# Altium project PUA.PrjPcb (part 14 of 14)

## Sheet Private_CPU_SerDes.SchDoc
size D
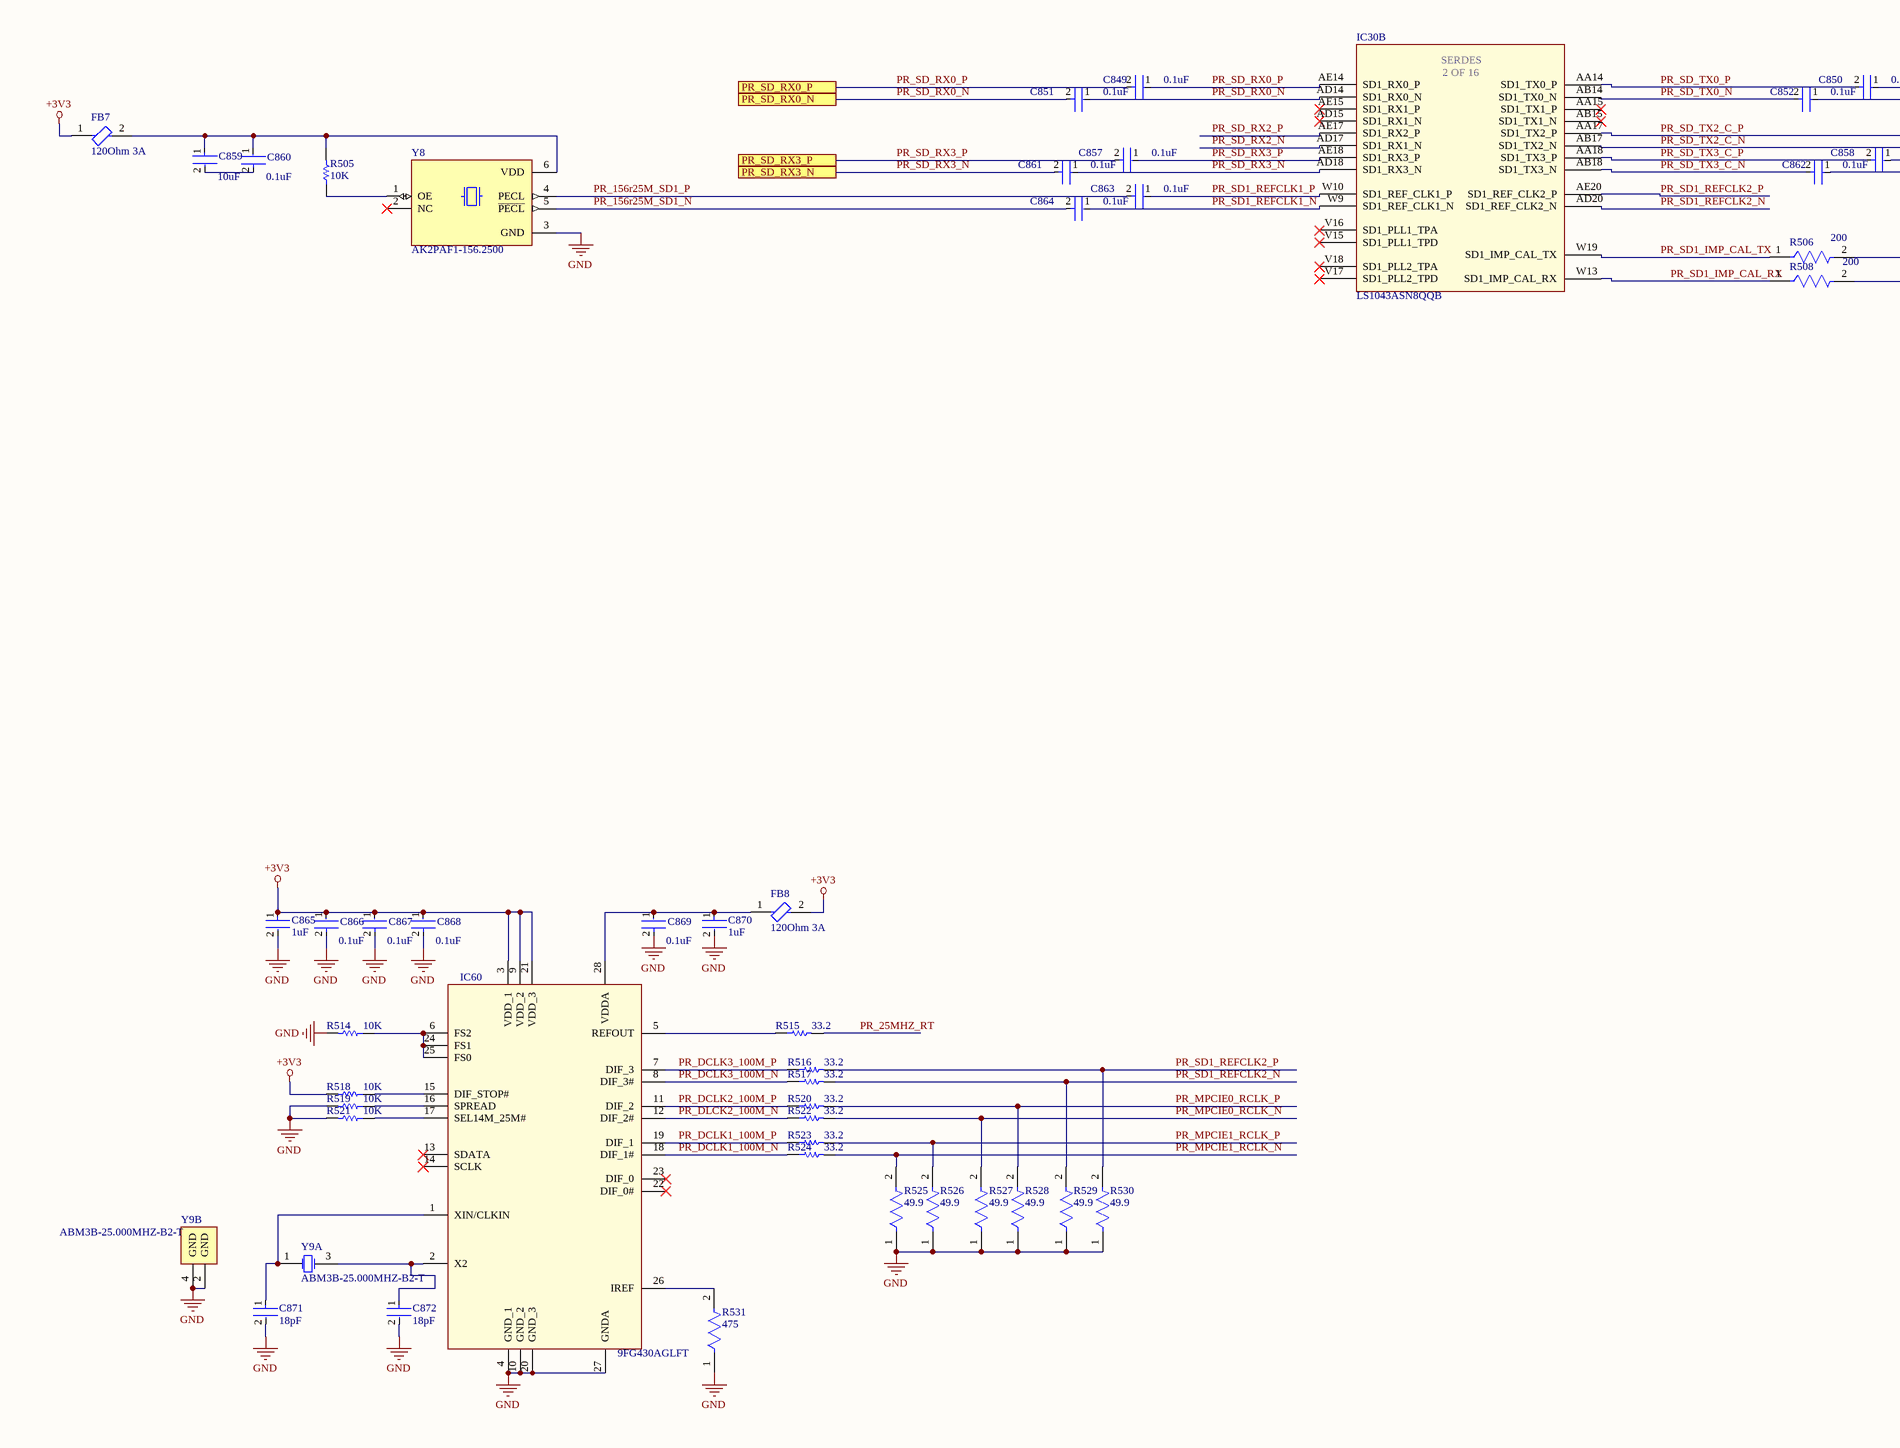
[diagram p70: Private_CPU_SerDes.SchDoc, left]
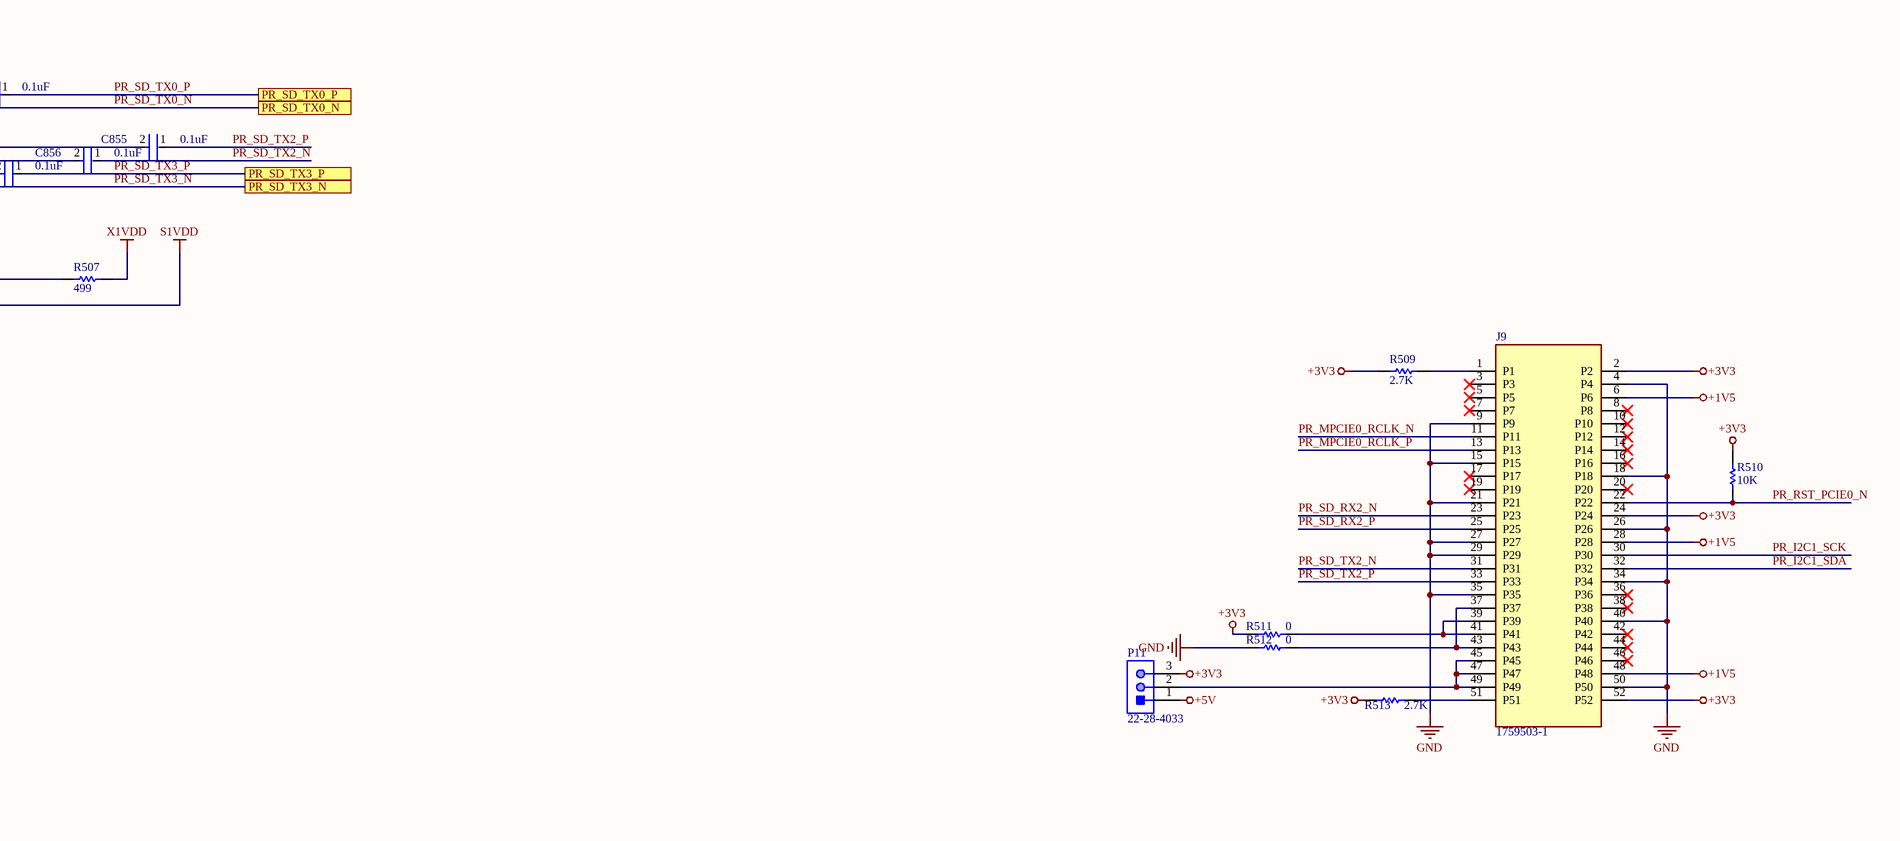
[diagram p71: Private_CPU_SerDes.SchDoc, right]

### Parts
C849  0.1uF  [FP-GRM15-MFG]
C850  0.1uF  [FP-GRM15-MFG]
C851  0.1uF  [FP-GRM15-MFG]
C852  0.1uF  [FP-GRM15-MFG]
C855  0.1uF  [FP-GRM15-MFG]
C856  0.1uF  [FP-GRM15-MFG]
C857  0.1uF  [FP-GRM15-MFG]
C858  0.1uF  [FP-GRM15-MFG]
C859  10uF  [FP-C0805C-DG-MFG]
C860  0.1uF  [FP-GRM15-MFG]
C861  0.1uF  [FP-GRM15-MFG]
C862  0.1uF  [FP-GRM15-MFG]
C863  0.1uF  [FP-GRM15-MFG]
C864  0.1uF  [FP-GRM15-MFG]
C865  1uF  [FP-GRM15-0_1-MFG]
C866  0.1uF  [FP-GRM15-MFG]
C867  0.1uF  [FP-GRM15-MFG]
C868  0.1uF  [FP-GRM15-MFG]
C869  0.1uF  [FP-GRM15-MFG]
C870  1uF  [FP-GRM15-0_1-MFG]
C871  18pF  [FP-C0402-BB-MFG]
C872  18pF  [FP-C0402-BB-MFG]
FB7  120Ohm 3A  [FP-BLM18-0_15-t0_5-d1_2-MFG]
FB8  120Ohm 3A  [FP-BLM18-0_15-t0_5-d1_2-MFG]
IC30  LS1043ASN8QQB  [BGA780C80P28X28_2300X2300X261]  (part B of 16)
IC60  9FG430AGLFT  [SOP65P640X120-28N]
J9  1759503-1  [TE_1759503-1]
P11  22-28-4033  [MOLX-22-28-4033_V]
R505  10K  [RESC1005X40X25LL05T05]
R506  200  [FP-CRCW0402-e3-IPC_C]
R507  499  [RESC1005X40X25LL05T05]
R508  200  [FP-CRCW0402-e3-IPC_C]
R509  2.7K  [RESC1005X40X25NL05T05]
R510  10K  [RESC1005X40X25LL05T05]
R511  0  [RESC2013X50X30LL20T20]
R512  0  [RESC2013X50X30LL20T20]
R513  2.7K  [RESC1005X40X25NL05T05]
R514  10K  [RESC1005X40X25LL05T05]
R515  33.2  [RESC1005X40X25LL05T05]
R516  33.2  [RESC1005X40X25LL05T05]
R517  33.2  [RESC1005X40X25LL05T05]
R518  10K  [RESC1005X40X25LL05T05]
R519  10K  [RESC1005X40X25LL05T05]
R520  33.2  [RESC1005X40X25LL05T05]
R521  10K  [RESC1005X40X25LL05T05]
R522  33.2  [RESC1005X40X25LL05T05]
R523  33.2  [RESC1005X40X25LL05T05]
R524  33.2  [RESC1005X40X25LL05T05]
R525  49.9  [FP-CRCW0402-e3-MFG]
R526  49.9  [FP-CRCW0402-e3-MFG]
R527  49.9  [FP-CRCW0402-e3-MFG]
R528  49.9  [FP-CRCW0402-e3-MFG]
R529  49.9  [FP-CRCW0402-e3-MFG]
R530  49.9  [FP-CRCW0402-e3-MFG]
R531  475  [FP-CRCW0603-e3-IPC_C]
Y8  AK2PAF1-156.2500  [XTAL_AK2PAF1-156.2500]
Y9  ABM3B-25.000MHZ-B2-T  [ABRA-ABM3B-4_V]  (parts A,B of 2)

### Ports
PR_SD_RX0_N, PR_SD_RX0_P, PR_SD_RX3_N, PR_SD_RX3_P, PR_SD_TX0_N, PR_SD_TX0_P, PR_SD_TX3_N, PR_SD_TX3_P

### Nets
+1V5: J9.6(P6) J9.28(P28) J9.48(P48)
+3V3: C865.1 C866.1 C867.1 C868.1 FB7.1 FB8.2 IC60.3(VDD_1) IC60.9(VDD_2) IC60.21(VDD_3) J9.2(P2) J9.24(P24) J9.52(P52) P11.3 R509.2 R510.2 R511.1 R513.2 R518.2
+5V: P11.1
GND: C865.2 C866.2 C867.2 C868.2 C869.2 C870.2 C871.2 C872.2 IC60.4(GND_1) IC60.10(GND_2) IC60.20(GND_3) IC60.27(GNDA) J9.4(P4) J9.9(P9) J9.15(P15) J9.18(P18) J9.21(P21) J9.26(P26) J9.27(P27) J9.29(P29) J9.34(P34) J9.35(P35) J9.40(P40) J9.50(P50) R512.1 R514.2 R519.2 R521.2 R525.1 R526.1 R527.1 R528.1 R529.1 R530.1 R531.1 Y8.3(GND) Y9.2(GND) Y9.4(GND)
S1VDD: R508.2
X1VDD: R507.2
PR_25MHZ_RT: R515.2
PR_156r25M_SD1_N: C864.2 Y8.5(~{PECL})
PR_156r25M_SD1_P: C863.2 Y8.4(PECL)
PR_DCLK1_100M_N: IC60.18(DIF_1#) R524.1
PR_DCLK1_100M_P: IC60.19(DIF_1) R523.1
PR_DCLK2_100M_P: IC60.11(DIF_2) R520.1
PR_DCLK3_100M_N: IC60.8(DIF_3#) R517.1
PR_DCLK3_100M_P: IC60.7(DIF_3) R516.1
PR_DLCK2_100M_N: IC60.12(DIF_2#) R522.1
PR_I2C1_SCK: J9.30(P30)
PR_I2C1_SDA: J9.32(P32)
PR_MPCIE0_RCLK_N: J9.11(P11) R522.2 R527.2
PR_MPCIE0_RCLK_P: J9.13(P13) R520.2 R528.2
PR_MPCIE1_RCLK_N: R524.2 R525.2
PR_MPCIE1_RCLK_P: R523.2 R526.2
PR_RST_PCIE0_N: J9.22(P22) R510.1
PR_SD1_IMP_CAL_RX: IC30.W13(SD1_IMP_CAL_RX) R508.1
PR_SD1_IMP_CAL_TX: IC30.W19(SD1_IMP_CAL_TX) R506.1
PR_SD1_REFCLK1_N: C864.1 IC30.W9(SD1_REF_CLK1_N)
PR_SD1_REFCLK1_P: C863.1 IC30.W10(SD1_REF_CLK1_P)
PR_SD1_REFCLK2_N: IC30.AD20(SD1_REF_CLK2_N) R517.2 R529.2
PR_SD1_REFCLK2_P: IC30.AE20(SD1_REF_CLK2_P) R516.2 R530.2
PR_SD_RX0_N: C851.1 C851.2 IC30.AD14(SD1_RX0_N) ; port PR_SD_RX0_N
PR_SD_RX0_P: C849.1 C849.2 IC30.AE14(SD1_RX0_P) ; port PR_SD_RX0_P
PR_SD_RX2_N: IC30.AD17(SD1_RX1_N) J9.23(P23)
PR_SD_RX2_P: IC30.AE17(SD1_RX2_P) J9.25(P25)
PR_SD_RX3_N: C861.1 C861.2 IC30.AD18(SD1_RX3_N) ; port PR_SD_RX3_N
PR_SD_RX3_P: C857.1 C857.2 IC30.AE18(SD1_RX3_P) ; port PR_SD_RX3_P
PR_SD_TX0_N: C852.1 C852.2 IC30.AB14(SD1_TX0_N) ; port PR_SD_TX0_N
PR_SD_TX0_P: C850.1 C850.2 IC30.AA14(SD1_TX0_P) ; port PR_SD_TX0_P
PR_SD_TX2_C_N: C856.2 IC30.AB17(SD1_TX2_N)
PR_SD_TX2_C_P: C855.2 IC30.AA17(SD1_TX2_P)
PR_SD_TX2_N: C856.1 J9.31(P31)
PR_SD_TX2_P: C855.1 J9.33(P33)
PR_SD_TX3_C_N: C862.2 IC30.AB18(SD1_TX3_N)
PR_SD_TX3_C_P: C858.2 IC30.AA18(SD1_TX3_P)
PR_SD_TX3_N: C862.1 ; port PR_SD_TX3_N
PR_SD_TX3_P: C858.1 ; port PR_SD_TX3_P
NetC859_1: C859.1 C860.1 FB7.2 R505.2 Y8.6(VDD)
NetC859_2: C859.2 C860.2
NetC869_1: C869.1 C870.1 FB8.1 IC60.28(VDDA)
NetC871_1: C871.1 IC60.1(XIN/CLKIN) Y9.1(X1)
NetC872_1: C872.1 IC60.2(X2) Y9.3(X2)
NetIC60_5: IC60.5(REFOUT) R515.1
NetIC60_6: IC60.6(FS2) IC60.24(FS1) IC60.25(FS0) R514.1
NetIC60_15: IC60.15(DIF_STOP#) R518.1
NetIC60_16: IC60.16(SPREAD) R519.1
NetIC60_17: IC60.17(SEL14M_25M#) R521.1
NetIC60_26: IC60.26(IREF) R531.2
NetJ9_1: J9.1(P1) R509.1
NetJ9_37: J9.37(P37) J9.43(P43) R512.2
NetJ9_39: J9.39(P39) J9.41(P41) R511.2
NetJ9_45: J9.45(P45) J9.47(P47) J9.49(P49) P11.2
NetJ9_51: J9.51(P51) R513.1
NetR505_1: R505.1 Y8.1(OE)
NetR506_2: R506.2 R507.1

Not connected (* = marked no-connect by the designer): IC30 AA15(SD1_TX1_P)* AB15(SD1_TX1_N)* AD15(SD1_RX1_N)* AE15(SD1_RX1_P)* V15(SD1_PLL1_TPD)* V16(SD1_PLL1_TPA)* V17(SD1_PLL2_TPD)* V18(SD1_PLL2_TPA)*; IC60 13(SDATA)* 14(SCLK)* 22(DIF_0#)* 23(DIF_0)*; J9 3(P3)* 5(P5)* 7(P7)* 8(P8)* 10(P10)* 12(P12)* 14(P14)* 16(P16)* 17(P17)* 19(P19)* 20(P20)* 36(P36)* 38(P38)* 42(P42)* 44(P44)* 46(P46)*; Y8 2(NC)*

### Notes on the sheet
- Title
- Size:
- Date:
- File:
- D
- Number:
- Time:
- Revision:
- Sheet
- of
- (in symbol LS1043ASN8QQB, part B) SERDES; 2 OF 16

### Library data of the parts
C849-C852 C855-C858 C860-C864 C866-C869 = CMP-2100-03641-2: as C1274 on sheet Server_CPU_Sub_Power_Supplies; RoHS: TRUE; Temperature Characteristic: X7R; Octopart: https://octopart.com/grm155r71c104ka88d-murata-196880; Digikey Description: CAP CER 0.1UF 16V X7R 0402; Device Class L3: Ceramic Capacitors; Height: 0.55mm; ComponentLink2Description: Datasheet; Temperature Range Low: -55°C; Ipc Land Pattern Name: CAPC10050X219; ComponentLink2URL: https://search.murata.co.jp/Ceramy/image/img/A01X/G101/ENG/GRM155R71H471KA01-01A.pdf; Device Class L1: Passive Components; Lead Free: yes; Category: Cap; Package: GRM15; Temperature: -55°C to +125°C; Device Class L2: Capacitors; Temperature Range High: +125°C; Mouser Description: 0402 0.1 uF 16V ±10 % Tolerance X7R SMT Multilayer Ceramic Capacitor
C859 = CMP-2007-03243-2: as C334 on sheet Public_CPU_SerDes; Device Class L2: Capacitors; Device Class L1: Passive Components; ComponentLink2URL: https://content.kemet.com/datasheets/KEM_C1006_X5R_SMD.pdf; Height: 1.4mm; Lead Free: Yes; Digikey Description: CAP CER 10UF 10V X5R 0805; Octopart: https://octopart.com/c0805c106k8pactu-kemet-98697; Capacitance: 10uF; Value: 10uF; Temperature Range Low: -55°C; Temperature: -55°C to +85°C; Automotive: No; Mouser Description: CAP CER 10UF 10V X5R 0805; Ipc Land Pattern Name: CAPC200125X125; Temperature Range High: +85°C; Voltage: 10V; RoHS: TRUE; Device Class L3: Ceramic Capacitors; ComponentLink2Description: Datasheet; Voltage Rating: 10V; Package: C0805C-DG; Temperature Characteristic: X5R; Category: Cap
C865 C870 = CMP-2008-04556-2: as C1271 on sheet Server_CPU_Sub_Power_Supplies; Octopart: https://octopart.com/grm155r61a105ke15d-murata-197442; Lead Free: Yes; ComponentLink2Description: Datasheet; Temperature: -55°C to +85°C; Temperature Range High: +85°C; Height: 0.55mm; Capacitance: 1uF; Ipc Land Pattern Name: CAPC10050X50; ComponentLink2URL: https://search.murata.co.jp/Ceramy/image/img/A01X/G101/ENG/GRM155R61A105KE15-01A.pdf; Temperature Range Low: -55°C; Device Class L2: Capacitors; Voltage Rating: 10V; RoHS: TRUE; Device Class L1: Passive Components; Device Class L3: Ceramic Capacitors; Temperature Characteristic: X5R; Mouser Description: 0402 1 uF 10 V ±10% Tolerance X5R Surface Mount Multilayer Ceramic Capacitor; Automotive: No; Package: GRM15-0.1; Digikey Description: CAP CER 1UF 10V X5R 0402; Value: 1uF; Category: Cap
C871 C872 = CMP-2008-03288-2: as C370 on sheet Public_CPU_SerDes; Ipc Land Pattern Name: CAPC10050X50; Capacitance: 18 pF; Category: Cap; RoHS: TRUE; Automotive: No; Temperature Range High: +125°C; Height: 0.55mm; ComponentLink2Description: Datasheet; Lead Free: Yes; Value: 18 pF; Device Class L3: Ceramic Capacitors; Device Class L1: Passive Components; Digikey Description: CAP CER 18PF 50V 5% NP0 0402; Device Class L2: Capacitors; Voltage Rating: 50 V; ComponentLink2URL: https://content.kemet.com/datasheets/KEM_C1002_X7R_SMD.pdf; Octopart: https://octopart.com/c0402c180j5gactu-kemet-9138803; Mouser Description: Multilayer Ceramic Capacitors MLCC - SMD/SMT 50volts 18pF C0G 5%; Temperature: -55°C to +125°C; Temperature Range Low: -55°C; Package: C0402-BB
FB7 FB8 = CMP-0686-00602-4: as FB1 on sheet Public_CPU_SerDes; Tolerance: 25%; REACH SVHC: No SVHC; Case/Package: 0603; Max DC Current: 3A; Core Material: Ferrite; Case Code (Metric): 1608; Frequency: 100MHz; Package Quantity: 1; Height: 0.8mm; Lead Free: Lead Free; Test Frequency: 100MHz; RoHS Compliant: Yes; DC Resistance-Max: 25mR; Min Operating Temperature: -55°C; Width: 0.8mm; Termination: SMD/SMT; Length: 1.6mm; Max Current Rating: 3A; Number of Lines: 1; Series: BLM18S; Number of Pins: 2; Packaging: Tape and Reel; Current Rating: 3A; Depth: 0.8mm; Case Code (Imperial): 0603; Max Operating Temperature: 125°C
IC30 = LS1043ASN8QQB: as IC1 on sheet Public_CPU_SerDes; Datasheet Link: http://www.nxp.com/secured/assets/documents/en/data-sheet/LS1088A.pdf; Height: 2.61mm; Manufacturer_Part_Number: LS1043ASN8QQB; Mouser Part Number: 771-LS1043ASN8QQB; Mouser Price/Stock: https://www.mouser.co.uk/ProductDetail/NXP-Semiconductors/LS1043ASN8QQB/?qs=AQlKX63v8RsTATOTx7X0Jg%3D%3D
IC60 = 9FG430AGLFT: as IC29 on sheet Public_CPU_SerDes; Datasheet Link: https://www.idt.com/document/dst/9fg430-datasheet; Height: 1.2mm; Manufacturer_Part_Number: 9FG430AGLFT
J9 = 1759503-1: as J5 on sheet Public_CPU_SerDes; MP: 1759503-1; Value: *; Price: None; Availability: Unavailable; Package: None
P11 = CMP-1676-00001-5: as P5 on sheet Public_CPU_SerDes; Min Operating Temperature: 0 degC; Lead Pitch: 0.1 inch; Packaging: Bulk; Contact Finish: Gold; RoHSCompliant: true; Contact Material: Brass; PackageReference: 22-28-4033; REACH SVHC: Unknown; PackageDescription: Male Header, Pitch 2.54 mm, 1 x 3 Position, Height 8.38 mm, Tail Length 3.18 mm; ComponentLink2URL: http://www.molex.com/pdm_docs/sd/022284033_sd.pdf; Height: 8.38 mm; Mounting Technology: Through Hole; ComponentLink1Description: Manufacturer URL; Length: 7.62 mm; Mount: Through Hole; DatasheetVersion: Rev. G, 01/2012; Max Operating Temperature: 75 degC; ComponentLink2Description: Datasheet; Colour: Black; Pins: 3; Contact Plating: Gold; Package Quantity: 1; ComponentLink1URL: http://www.molex.com/
R505 R510 R514 R518 R519 R521 = CMP-2000-07588-1: as R748-R751 on sheet Server_CPU_Sub_Power_Supplies; RoHSCompliant: True; Lead Free: LeadFree; Package Quantity: 1; Contact Plating: Tin; Length: 1mm; Radiation Hardening: No; REACH SVHC: NoSVHC; Max Operating Temperature: 155degC; Depth: 0.5mm; Case Code (Imperial): 0402; Military Standard: Not; Package Description: 2-Pin Surface Mount Device, Body 1 x 0.5 mm; Termination: SMD/SMT; Case Code (Metric): 1005; Height: 0.35mm; Packaging: TapeandReel; Voltage Rating (DC): 50V; Package Reference: 402; Number of Pins: 2; Tolerance: 1%; Mounting Technology: SurfaceMount; Width: 0.02inch; Mount: SurfaceMount; Datasheet URL: https://industrial.panasonic.com/cdbs/www-data/pdf/RDA0000/AOA0000C304.pdf; Composition: ThickFilm; Datasheet Version: 02/2017; Manufacturer URL: http://www.panasonic.com/; Max Power Dissipation: 100mW; Number of Terminations: 2; Min Operating Temperature: -55degC
R506 R508 = CMP-1011-00429-3: as R228 on sheet Public_CPU_SerDes; Termination: SMD/SMT; Weight: 2.3E-05oz; Case/Package: 0402; Contact Plating: Tin; Number of Pins: 2; Width: 0.5mm; Height: 0.35mm; Case Code (Metric): 1005; Military Standard: Not; Features: Automotive AEC-Q200; Power Rating: 63mW; Temperature Coefficient: 100ppm/°C; Tolerance: 1%; Lead Free: Lead Free; Depth: 0.5mm; Max Operating Temperature: 155°C; Min Operating Temperature: -55°C; Package Quantity: 10; Voltage Rating (DC): 50V; Composition: Thick Film; Mount: Surface Mount; Radiation Hardening: No; Length: 1mm; Packaging: Tape and Reel; Number of Terminations: 2; Case Code (Imperial): 0402
R507 = CMP-2002-00965-1: as R229 on sheet Public_CPU_SerDes
R509 R513 = CMP-1011-00557-2: as R196 on sheet Public_CPU_SerDes
R511 R512 = CMP-2001-04896-1: as R224 on sheet Public_CPU_SerDes
R515-R517 R520 R522-R524 = CMP-2002-08532-1: as R232-R234 on sheet Public_CPU_SerDes
R525-R530 = CMP-1011-00363-3: as R242-R247 on sheet Public_CPU_SerDes; Temperature Coefficient: 100ppm/°C; Packaging: Tape and Reel; Height: 0.35mm; Length: 1mm; Case Code (Metric): 1005; Weight: 2.3E-05oz; Case Code (Imperial): 0402; Voltage Rating (DC): 50V; Composition: Thick Film; Lead Free: Lead Free; Package Quantity: 10; Number of Terminations: 2; Width: 0.5mm; Max Operating Temperature: 155°C; Depth: 0.5mm; Max Power Dissipation: 63mW; Tolerance: 1%; Radiation Hardening: No; Features: Automotive AEC-Q200; Min Operating Temperature: -55°C; Contact Plating: Tin; Mount: Surface Mount; Military Standard: Not; Termination: SMD/SMT; Case/Package: 0402
R531 = CMP-2000-03377-2: as R248 on sheet Public_CPU_SerDes; Termination: SMD/SMT; Weight: 7.1E-05oz; Case Code (Imperial): 0603; Tolerance: 1%; Case/Package: 0603; Length: 1.55mm; Case Code (Metric): 1608; Packaging: Tape and Reel; Max Operating Temperature: 155°C; Width: 0.033inch; Temperature Coefficient: 100ppm/°C; Contact Plating: Tin; Composition: Thick Film; Voltage Rating: 75V; Number of Terminations: 2; Depth: 0.85mm; Lead Free: Lead Free; Height: 0.45mm; Features: Automotive AEC-Q200; Package Quantity: 10; Military Standard: Not; Max Power Dissipation: 100mW; Radiation Hardening: No; Min Operating Temperature: -55°C; Mount: Surface Mount
Y8 = AK2PAF1-156.2500: as Y3 on sheet Public_CPU_SerDes; Package: None; MP: AK2PAF1-156.2500; Availability: Unavailable; Price: None; Value: *
Y9 = CMP-0277-00001-1: as Y4 on sheet Public_CPU_SerDes; Case Size: 5.0 x 3.2 mm; PackageDescription: 4-Pin SMT Crystal, 5.2 x 3.4 mm Body; ComponentLink2Description: Datasheet; Mounting Technology: Surface Mount; ComponentLink1URL: http://www.abracon.com/; PackageReference: ABM3B; DatasheetVersion: Apr-13; PartNumber: ABM3B-25.000MHZ-B2-T; ComponentLink2URL: http://www.abracon.com/Resonators/abm3b.pdf; ComponentLink1Description: Manufacturer URL; Storage Temperature: -40 to 80 degC

## Sheet Server_CPU_SerDes.SchDoc
size D
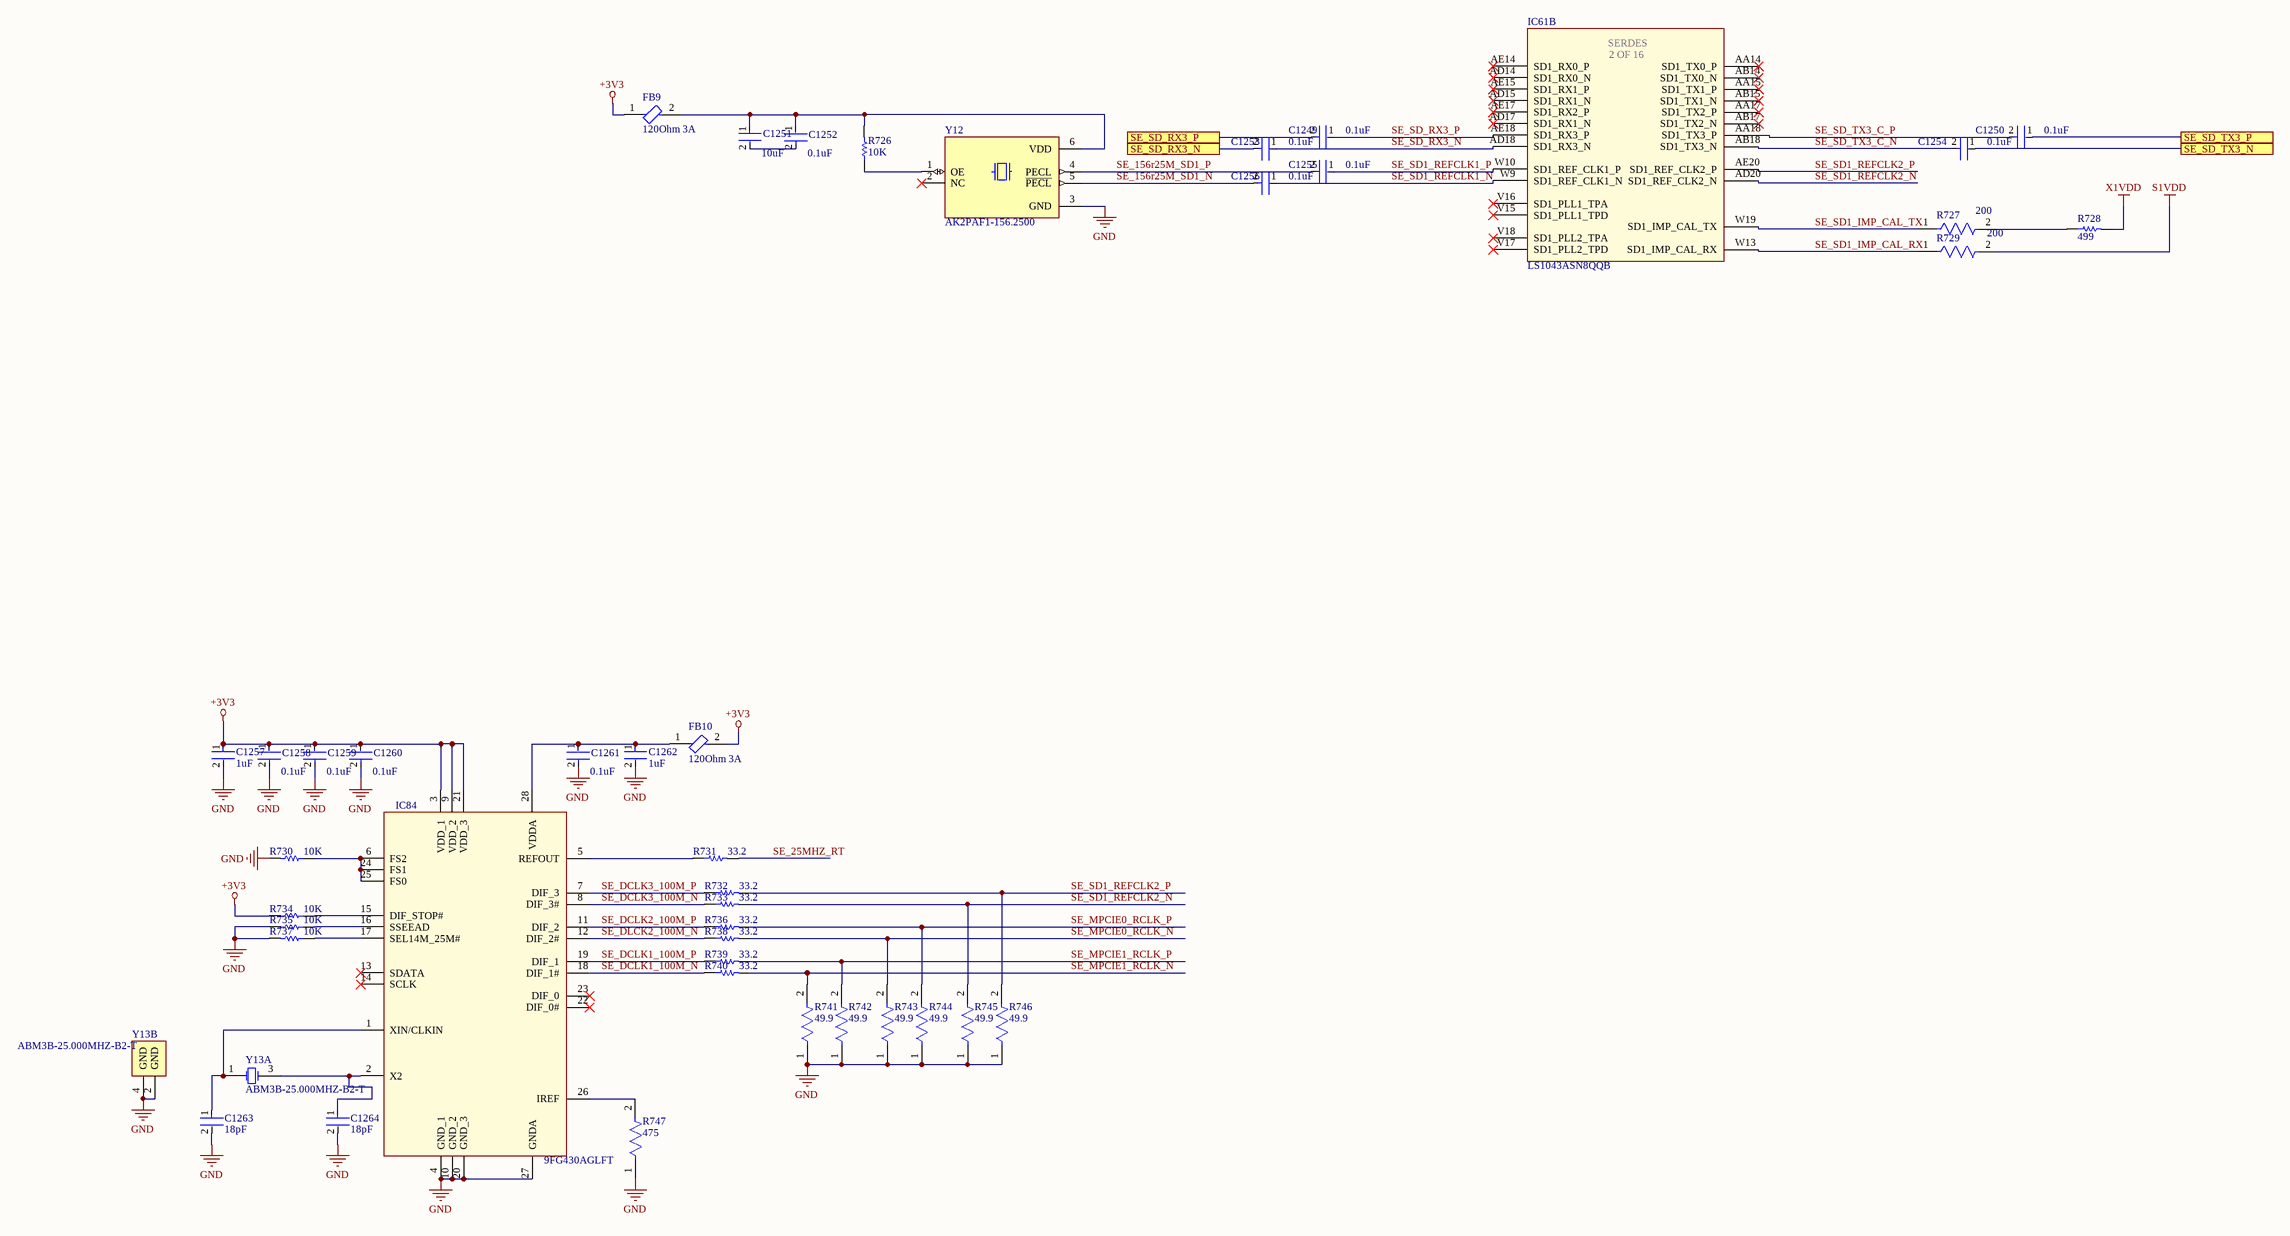
[diagram p72: Server_CPU_SerDes.SchDoc]

### Parts
C1249  0.1uF  [FP-GRM15-MFG]
C1250  0.1uF  [FP-GRM15-MFG]
C1251  10uF  [FP-C0805C-DG-MFG]
C1252  0.1uF  [FP-GRM15-MFG]
C1253  0.1uF  [FP-GRM15-MFG]
C1254  0.1uF  [FP-GRM15-MFG]
C1255  0.1uF  [FP-GRM15-MFG]
C1256  0.1uF  [FP-GRM15-MFG]
C1257  1uF  [FP-GRM15-0_1-MFG]
C1258  0.1uF  [FP-GRM15-MFG]
C1259  0.1uF  [FP-GRM15-MFG]
C1260  0.1uF  [FP-GRM15-MFG]
C1261  0.1uF  [FP-GRM15-MFG]
C1262  1uF  [FP-GRM15-0_1-MFG]
C1263  18pF  [FP-C0402-BB-MFG]
C1264  18pF  [FP-C0402-BB-MFG]
FB9  120Ohm 3A  [FP-BLM18-0_15-t0_5-d1_2-MFG]
FB10  120Ohm 3A  [FP-BLM18-0_15-t0_5-d1_2-MFG]
IC61  LS1043ASN8QQB  [BGA780C80P28X28_2300X2300X261]  (part B of 16)
IC84  9FG430AGLFT  [SOP65P640X120-28N]
R726  10K  [RESC1005X40X25LL05T05]
R727  200  [FP-CRCW0402-e3-IPC_C]
R728  499  [RESC1005X40X25LL05T05]
R729  200  [FP-CRCW0402-e3-IPC_C]
R730  10K  [RESC1005X40X25LL05T05]
R731  33.2  [RESC1005X40X25LL05T05]
R732  33.2  [RESC1005X40X25LL05T05]
R733  33.2  [RESC1005X40X25LL05T05]
R734  10K  [RESC1005X40X25LL05T05]
R735  10K  [RESC1005X40X25LL05T05]
R736  33.2  [RESC1005X40X25LL05T05]
R737  10K  [RESC1005X40X25LL05T05]
R738  33.2  [RESC1005X40X25LL05T05]
R739  33.2  [RESC1005X40X25LL05T05]
R740  33.2  [RESC1005X40X25LL05T05]
R741  49.9  [FP-CRCW0402-e3-MFG]
R742  49.9  [FP-CRCW0402-e3-MFG]
R743  49.9  [FP-CRCW0402-e3-MFG]
R744  49.9  [FP-CRCW0402-e3-MFG]
R745  49.9  [FP-CRCW0402-e3-MFG]
R746  49.9  [FP-CRCW0402-e3-MFG]
R747  475  [FP-CRCW0603-e3-IPC_C]
Y12  AK2PAF1-156.2500  [XTAL_AK2PAF1-156.2500]
Y13  ABM3B-25.000MHZ-B2-T  [ABRA-ABM3B-4_V]  (parts A,B of 2)

### Ports
SE_SD_RX3_N, SE_SD_RX3_P, SE_SD_TX3_N, SE_SD_TX3_P

### Nets
+3V3: C1257.1 C1258.1 C1259.1 C1260.1 FB9.1 FB10.2 IC84.3(VDD_1) IC84.9(VDD_2) IC84.21(VDD_3) R734.2
GND: C1257.2 C1258.2 C1259.2 C1260.2 C1261.2 C1262.2 C1263.2 C1264.2 IC84.4(GND_1) IC84.10(GND_2) IC84.20(GND_3) IC84.27(GNDA) R730.2 R735.2 R737.2 R741.1 R742.1 R743.1 R744.1 R745.1 R746.1 R747.1 Y12.3(GND) Y13.2(GND) Y13.4(GND)
S1VDD: R729.2
X1VDD: R728.2
SE_25MHZ_RT: R731.2
SE_156r25M_SD1_N: C1256.2 Y12.5(~{PECL})
SE_156r25M_SD1_P: C1255.2 Y12.4(PECL)
SE_DCLK1_100M_N: IC84.18(DIF_1#) R740.1
SE_DCLK1_100M_P: IC84.19(DIF_1) R739.1
SE_DCLK2_100M_P: IC84.11(DIF_2) R736.1
SE_DCLK3_100M_N: IC84.8(DIF_3#) R733.1
SE_DCLK3_100M_P: IC84.7(DIF_3) R732.1
SE_DLCK2_100M_N: IC84.12(DIF_2#) R738.1
SE_MPCIE0_RCLK_N: R738.2 R743.2
SE_MPCIE0_RCLK_P: R736.2 R744.2
SE_MPCIE1_RCLK_N: R740.2 R741.2
SE_MPCIE1_RCLK_P: R739.2 R742.2
SE_SD1_IMP_CAL_RX: IC61.W13(SD1_IMP_CAL_RX) R729.1
SE_SD1_IMP_CAL_TX: IC61.W19(SD1_IMP_CAL_TX) R727.1
SE_SD1_REFCLK1_N: C1256.1 IC61.W9(SD1_REF_CLK1_N)
SE_SD1_REFCLK1_P: C1255.1 IC61.W10(SD1_REF_CLK1_P)
SE_SD1_REFCLK2_N: IC61.AD20(SD1_REF_CLK2_N) R733.2 R745.2
SE_SD1_REFCLK2_P: IC61.AE20(SD1_REF_CLK2_P) R732.2 R746.2
SE_SD_RX3_N: C1253.1 IC61.AD18(SD1_RX3_N)
SE_SD_RX3_P: C1249.1 IC61.AE18(SD1_RX3_P)
SE_SD_TX3_C_N: C1254.2 IC61.AB18(SD1_TX3_N)
SE_SD_TX3_C_P: C1250.2 IC61.AA18(SD1_TX3_P)
NetC1249_2: C1249.2 ; port SE_SD_RX3_P
NetC1250_1: C1250.1 ; port SE_SD_TX3_P
NetC1251_1: C1251.1 C1252.1 FB9.2 R726.2 Y12.6(VDD)
NetC1251_2: C1251.2 C1252.2
NetC1253_2: C1253.2 ; port SE_SD_RX3_N
NetC1254_1: C1254.1 ; port SE_SD_TX3_N
NetC1261_1: C1261.1 C1262.1 FB10.1 IC84.28(VDDA)
NetC1263_1: C1263.1 IC84.1(XIN/CLKIN) Y13.1(X1)
NetC1264_1: C1264.1 IC84.2(X2) Y13.3(X2)
NetIC84_5: IC84.5(REFOUT) R731.1
NetIC84_6: IC84.6(FS2) IC84.24(FS1) IC84.25(FS0) R730.1
NetIC84_15: IC84.15(DIF_STOP#) R734.1
NetIC84_16: IC84.16(SSEEAD) R735.1
NetIC84_17: IC84.17(SEL14M_25M#) R737.1
NetIC84_26: IC84.26(IREF) R747.2
NetR726_1: R726.1 Y12.1(OE)
NetR727_2: R727.2 R728.1

Not connected (* = marked no-connect by the designer): IC61 AA14(SD1_TX0_P)* AA15(SD1_TX1_P)* AA17(SD1_TX2_P)* AB14(SD1_TX0_N)* AB15(SD1_TX1_N)* AB17(SD1_TX2_N)* AD14(SD1_RX0_N)* AD15(SD1_RX1_N)* AD17(SD1_RX1_N)* AE14(SD1_RX0_P)* AE15(SD1_RX1_P)* AE17(SD1_RX2_P)* V15(SD1_PLL1_TPD)* V16(SD1_PLL1_TPA)* V17(SD1_PLL2_TPD)* V18(SD1_PLL2_TPA)*; IC84 13(SDATA)* 14(SCLK)* 22(DIF_0#)* 23(DIF_0)*; Y12 2(NC)*

### Notes on the sheet
- (in symbol LS1043ASN8QQB, part B) SERDES; 2 OF 16

### Library data of the parts
C1249 C1250 C1252-C1256 C1258-C1261 = CMP-2100-03641-2: as C1274 on sheet Server_CPU_Sub_Power_Supplies; RoHS: TRUE; Temperature Characteristic: X7R; Octopart: https://octopart.com/grm155r71c104ka88d-murata-196880; Digikey Description: CAP CER 0.1UF 16V X7R 0402; Device Class L3: Ceramic Capacitors; Height: 0.55mm; ComponentLink2Description: Datasheet; Temperature Range Low: -55°C; Ipc Land Pattern Name: CAPC10050X219; ComponentLink2URL: https://search.murata.co.jp/Ceramy/image/img/A01X/G101/ENG/GRM155R71H471KA01-01A.pdf; Device Class L1: Passive Components; Lead Free: yes; Category: Cap; Package: GRM15; Temperature: -55°C to +125°C; Device Class L2: Capacitors; Temperature Range High: +125°C; Mouser Description: 0402 0.1 uF 16V ±10 % Tolerance X7R SMT Multilayer Ceramic Capacitor
C1251 = CMP-2007-03243-2: as C334 on sheet Public_CPU_SerDes; Device Class L2: Capacitors; Device Class L1: Passive Components; ComponentLink2URL: https://content.kemet.com/datasheets/KEM_C1006_X5R_SMD.pdf; Height: 1.4mm; Lead Free: Yes; Digikey Description: CAP CER 10UF 10V X5R 0805; Octopart: https://octopart.com/c0805c106k8pactu-kemet-98697; Capacitance: 10uF; Value: 10uF; Temperature Range Low: -55°C; Temperature: -55°C to +85°C; Automotive: No; Mouser Description: CAP CER 10UF 10V X5R 0805; Ipc Land Pattern Name: CAPC200125X125; Temperature Range High: +85°C; Voltage: 10V; RoHS: TRUE; Device Class L3: Ceramic Capacitors; ComponentLink2Description: Datasheet; Voltage Rating: 10V; Package: C0805C-DG; Temperature Characteristic: X5R; Category: Cap
C1257 C1262 = CMP-2008-04556-2: as C1271 on sheet Server_CPU_Sub_Power_Supplies; Octopart: https://octopart.com/grm155r61a105ke15d-murata-197442; Lead Free: Yes; ComponentLink2Description: Datasheet; Temperature: -55°C to +85°C; Temperature Range High: +85°C; Height: 0.55mm; Capacitance: 1uF; Ipc Land Pattern Name: CAPC10050X50; ComponentLink2URL: https://search.murata.co.jp/Ceramy/image/img/A01X/G101/ENG/GRM155R61A105KE15-01A.pdf; Temperature Range Low: -55°C; Device Class L2: Capacitors; Voltage Rating: 10V; RoHS: TRUE; Device Class L1: Passive Components; Device Class L3: Ceramic Capacitors; Temperature Characteristic: X5R; Mouser Description: 0402 1 uF 10 V ±10% Tolerance X5R Surface Mount Multilayer Ceramic Capacitor; Automotive: No; Package: GRM15-0.1; Digikey Description: CAP CER 1UF 10V X5R 0402; Value: 1uF; Category: Cap
C1263 C1264 = CMP-2008-03288-2: as C370 on sheet Public_CPU_SerDes; Ipc Land Pattern Name: CAPC10050X50; Capacitance: 18 pF; Category: Cap; RoHS: TRUE; Automotive: No; Temperature Range High: +125°C; Height: 0.55mm; ComponentLink2Description: Datasheet; Lead Free: Yes; Value: 18 pF; Device Class L3: Ceramic Capacitors; Device Class L1: Passive Components; Digikey Description: CAP CER 18PF 50V 5% NP0 0402; Device Class L2: Capacitors; Voltage Rating: 50 V; ComponentLink2URL: https://content.kemet.com/datasheets/KEM_C1002_X7R_SMD.pdf; Octopart: https://octopart.com/c0402c180j5gactu-kemet-9138803; Mouser Description: Multilayer Ceramic Capacitors MLCC - SMD/SMT 50volts 18pF C0G 5%; Temperature: -55°C to +125°C; Temperature Range Low: -55°C; Package: C0402-BB
FB9 FB10 = CMP-0686-00602-4: as FB1 on sheet Public_CPU_SerDes; Tolerance: 25%; REACH SVHC: No SVHC; Case/Package: 0603; Max DC Current: 3A; Core Material: Ferrite; Case Code (Metric): 1608; Frequency: 100MHz; Package Quantity: 1; Height: 0.8mm; Lead Free: Lead Free; Test Frequency: 100MHz; RoHS Compliant: Yes; DC Resistance-Max: 25mR; Min Operating Temperature: -55°C; Width: 0.8mm; Termination: SMD/SMT; Length: 1.6mm; Max Current Rating: 3A; Number of Lines: 1; Series: BLM18S; Number of Pins: 2; Packaging: Tape and Reel; Current Rating: 3A; Depth: 0.8mm; Case Code (Imperial): 0603; Max Operating Temperature: 125°C
IC61 = LS1043ASN8QQB: as IC1 on sheet Public_CPU_SerDes; Datasheet Link: http://www.nxp.com/secured/assets/documents/en/data-sheet/LS1088A.pdf; Height: 2.61mm; Manufacturer_Part_Number: LS1043ASN8QQB; Mouser Part Number: 771-LS1043ASN8QQB; Mouser Price/Stock: https://www.mouser.co.uk/ProductDetail/NXP-Semiconductors/LS1043ASN8QQB/?qs=AQlKX63v8RsTATOTx7X0Jg%3D%3D
IC84 = 9FG430AGLFT: as IC29 on sheet Public_CPU_SerDes; Datasheet Link: https://www.idt.com/document/dst/9fg430-datasheet; Height: 1.2mm; Manufacturer_Part_Number: 9FG430AGLFT
R726 R730 R734 R735 R737 = CMP-2000-07588-1: as R748-R751 on sheet Server_CPU_Sub_Power_Supplies; RoHSCompliant: True; Lead Free: LeadFree; Package Quantity: 1; Contact Plating: Tin; Length: 1mm; Radiation Hardening: No; REACH SVHC: NoSVHC; Max Operating Temperature: 155degC; Depth: 0.5mm; Case Code (Imperial): 0402; Military Standard: Not; Package Description: 2-Pin Surface Mount Device, Body 1 x 0.5 mm; Termination: SMD/SMT; Case Code (Metric): 1005; Height: 0.35mm; Packaging: TapeandReel; Voltage Rating (DC): 50V; Package Reference: 402; Number of Pins: 2; Tolerance: 1%; Mounting Technology: SurfaceMount; Width: 0.02inch; Mount: SurfaceMount; Datasheet URL: https://industrial.panasonic.com/cdbs/www-data/pdf/RDA0000/AOA0000C304.pdf; Composition: ThickFilm; Datasheet Version: 02/2017; Manufacturer URL: http://www.panasonic.com/; Max Power Dissipation: 100mW; Number of Terminations: 2; Min Operating Temperature: -55degC
R727 R729 = CMP-1011-00429-3: as R228 on sheet Public_CPU_SerDes; Termination: SMD/SMT; Weight: 2.3E-05oz; Case/Package: 0402; Contact Plating: Tin; Number of Pins: 2; Width: 0.5mm; Height: 0.35mm; Case Code (Metric): 1005; Military Standard: Not; Features: Automotive AEC-Q200; Power Rating: 63mW; Temperature Coefficient: 100ppm/°C; Tolerance: 1%; Lead Free: Lead Free; Depth: 0.5mm; Max Operating Temperature: 155°C; Min Operating Temperature: -55°C; Package Quantity: 10; Voltage Rating (DC): 50V; Composition: Thick Film; Mount: Surface Mount; Radiation Hardening: No; Length: 1mm; Packaging: Tape and Reel; Number of Terminations: 2; Case Code (Imperial): 0402
R728 = CMP-2002-00965-1: as R229 on sheet Public_CPU_SerDes
R731-R733 R736 R738-R740 = CMP-2002-08532-1: as R232-R234 on sheet Public_CPU_SerDes
R741-R746 = CMP-1011-00363-3: as R242-R247 on sheet Public_CPU_SerDes; Temperature Coefficient: 100ppm/°C; Packaging: Tape and Reel; Height: 0.35mm; Length: 1mm; Case Code (Metric): 1005; Weight: 2.3E-05oz; Case Code (Imperial): 0402; Voltage Rating (DC): 50V; Composition: Thick Film; Lead Free: Lead Free; Package Quantity: 10; Number of Terminations: 2; Width: 0.5mm; Max Operating Temperature: 155°C; Depth: 0.5mm; Max Power Dissipation: 63mW; Tolerance: 1%; Radiation Hardening: No; Features: Automotive AEC-Q200; Min Operating Temperature: -55°C; Contact Plating: Tin; Mount: Surface Mount; Military Standard: Not; Termination: SMD/SMT; Case/Package: 0402
R747 = CMP-2000-03377-2: as R248 on sheet Public_CPU_SerDes; Termination: SMD/SMT; Weight: 7.1E-05oz; Case Code (Imperial): 0603; Tolerance: 1%; Case/Package: 0603; Length: 1.55mm; Case Code (Metric): 1608; Packaging: Tape and Reel; Max Operating Temperature: 155°C; Width: 0.033inch; Temperature Coefficient: 100ppm/°C; Contact Plating: Tin; Composition: Thick Film; Voltage Rating: 75V; Number of Terminations: 2; Depth: 0.85mm; Lead Free: Lead Free; Height: 0.45mm; Features: Automotive AEC-Q200; Package Quantity: 10; Military Standard: Not; Max Power Dissipation: 100mW; Radiation Hardening: No; Min Operating Temperature: -55°C; Mount: Surface Mount
Y12 = AK2PAF1-156.2500: as Y3 on sheet Public_CPU_SerDes; Package: None; MP: AK2PAF1-156.2500; Availability: Unavailable; Price: None; Value: *
Y13 = CMP-0277-00001-1: as Y4 on sheet Public_CPU_SerDes; Case Size: 5.0 x 3.2 mm; PackageDescription: 4-Pin SMT Crystal, 5.2 x 3.4 mm Body; ComponentLink2Description: Datasheet; Mounting Technology: Surface Mount; ComponentLink1URL: http://www.abracon.com/; PackageReference: ABM3B; DatasheetVersion: Apr-13; PartNumber: ABM3B-25.000MHZ-B2-T; ComponentLink2URL: http://www.abracon.com/Resonators/abm3b.pdf; ComponentLink1Description: Manufacturer URL; Storage Temperature: -40 to 80 degC

## Nets that join several sheets
+1V5: Public_CPU_Sub_Power_Supplies (8 pins), Private_CPU_Sub_Power_Supplies (8 pins), Server_CPU_Sub_Power_Supplies (8 pins), Public_CPU_SerDes (J5.6 J5.28 J5.48), Private_CPU_SerDes (J9.6 J9.28 J9.48)
+1V8: Public_CPU_Power (29 pins), Public_CPU_Reset_IO (43 pins), Public_CPU_IO (24 pins), Public_CPU_Sub_Power_Supplies (C581.2 C582.2 L33.1 U5.25), Private_CPU_Power (29 pins), Private_CPU_Reset_IO (41 pins), Private_CPU_IO (24 pins), Private_CPU_Sub_Power_Supplies (C907.2 C908.2 L43.1 U11.25), Server_CPU_Power (29 pins), Server_CPU_Reset_IO (41 pins), Server_CPU_IO (24 pins), Server_CPU_Sub_Power_Supplies (C1299.2 C1300.2 L62.1 U15.25)
+2V4_VPP: Public_CPU_DDR4 (32 pins), Private_CPU_DDR4 (32 pins), Server_CPU_DDR4 (32 pins)
+2V5: Main_Power (9 pins), Public_CPU_Power (L4.2 L7.1), Public_CPU_Reset_IO (R42.2), Public_QSGMII_ETHERNET_POWER (26 pins), Private_CPU_Power (L21.2 L24.1), Private_CPU_Reset_IO (R351.2), Server_CPU_Power (L48.2 L51.1), Server_CPU_Reset_IO (R576.2)
+2V5_VPP: Public_CPU_Sub_Power_Supplies (C552.2 U5.28), Private_CPU_Sub_Power_Supplies (C878.2 U11.28), Server_CPU_Sub_Power_Supplies (C1270.2 U15.28)
+3V3: Main_Power (37 pins), Public_CPU_Power (L3.2 L6.2), Public_CPU_Reset_IO (28 pins), Public_CPU_USB (5 pins), Public_CPU_DDR4 (C226.1 IC24.2 IC24.8), Public_CPU_Sub_Power_Supplies (29 pins), Public_QSGMII_ETHERNET (8 pins), Public_QSGMII_ETHERNET_POWER (FB3.2), Private_CPU_Power (7 pins), Private_CPU_Reset_IO (28 pins), Private_CPU_DDR4 (C742.1 IC59.2 IC59.8), Private_CPU_Sub_Power_Supplies (29 pins), Server_CPU_Power (7 pins), Server_CPU_Reset_IO (28 pins), Server_CPU_USB (5 pins), Server_CPU_DDR4 (C1136.1 IC83.2 IC83.8), Server_CPU_Sub_Power_Supplies (29 pins), Public_CPU_SerDes (53 pins), Private_CPU_SerDes (18 pins), Server_CPU_SerDes (10 pins)
+5V: Main_Power (23 pins), Public_CPU_USB (C185.2 IC14.1 IC14.5), Server_CPU_USB (C1096.2 IC73.1 IC73.5), Public_CPU_SerDes (P5.1), Private_CPU_SerDes (P11.1)
+C_VDD: Private_CPU_Reset_IO (R388.1), Server_CPU_Reset_IO (R613.1)
+CPU_VDD: Main_Power (R296.1 R297.2), Public_CPU_Power (87 pins), Public_CPU_Reset_IO (R80.1), Public_QSGMII_ETHERNET_POWER (FB4.2), Private_CPU_Power (87 pins), Server_CPU_Power (87 pins)
+GVDD: Public_CPU_Power (55 pins), Public_CPU_DDR4 (195 pins), Public_CPU_Sub_Power_Supplies (9 pins), Private_CPU_Power (23 pins), Private_CPU_DDR4 (195 pins), Private_CPU_Sub_Power_Supplies (9 pins), Server_CPU_Power (23 pins), Server_CPU_DDR4 (195 pins), Server_CPU_Sub_Power_Supplies (9 pins)
+GVVD: Private_CPU_Power (32 pins), Server_CPU_Power (32 pins)
BAKUP1: Public_CPU_Sub_Power_Supplies (C554.2 U5.39), Private_CPU_Sub_Power_Supplies (C880.2 U11.39), Server_CPU_Sub_Power_Supplies (C1272.2 U15.39)
BAKUP2: Public_CPU_Sub_Power_Supplies (C555.2 U5.41), Private_CPU_Sub_Power_Supplies (C881.2 U11.41), Server_CPU_Sub_Power_Supplies (C1273.2 U15.41)
DDR_VREF: Public_CPU_DDR4 (24 pins), Public_CPU_Sub_Power_Supplies (C553.1 U5.31), Private_CPU_DDR4 (24 pins), Private_CPU_Sub_Power_Supplies (C879.1 U11.31), Server_CPU_DDR4 (24 pins), Server_CPU_Sub_Power_Supplies (C1271.1 U15.31)
DDR_VTT: Public_CPU_DDR4 (47 pins), Public_CPU_Sub_Power_Supplies (C583.1 C584.1 L34.2 U5.19), Private_CPU_DDR4 (47 pins), Private_CPU_Sub_Power_Supplies (C909.1 C910.1 L44.2 U11.19), Server_CPU_DDR4 (47 pins), Server_CPU_Sub_Power_Supplies (C1301.1 C1302.1 L63.2 U15.19)
EN_+VDD: Main_Power (IC35.F5 IC35.F9 IC36.F5 IC36.F9), Public_CPU_Sub_Power_Supplies (C551.2 U5.26), Private_CPU_Sub_Power_Supplies (C877.2 U11.26), Server_CPU_Sub_Power_Supplies (C1269.2 U15.26)
EVVD: Private_CPU_Power (5 pins), Server_CPU_Power (5 pins)
GND: Main_Power (189 pins), Public_CPU_Power (291 pins), Public_CPU_Reset_IO (61 pins), Public_CPU_IO (16 pins), Public_CPU_USB (39 pins), Public_CPU_DDR4 (253 pins), Public_CPU_RGMII (45 pins), Public_CPU_Sub_Power_Supplies (52 pins), Public_QSGMII_ETHERNET (18 pins), Public_QSGMII_ETHERNET_POWER (37 pins), Private_CPU_Power (271 pins), Private_CPU_Reset_IO (50 pins), Private_CPU_IO (16 pins), Private_CPU_USB (13 pins), Private_CPU_DDR4 (254 pins), Private_CPU_RGMII (45 pins), Private_CPU_Sub_Power_Supplies (52 pins), Server_CPU_Power (271 pins), Server_CPU_Reset_IO (50 pins), Server_CPU_IO (16 pins), Server_CPU_USB (34 pins), Server_CPU_DDR4 (252 pins), Server_CPU_RGMII (45 pins), Server_CPU_Sub_Power_Supplies (52 pins), Public_CPU_SerDes (91 pins), Private_CPU_SerDes (38 pins), Server_CPU_SerDes (25 pins)
PWR_X1VDD: Public_CPU_Power (5 pins), Public_CPU_Sub_Power_Supplies (C550.2 U5.18), Private_CPU_Power (5 pins), Private_CPU_Sub_Power_Supplies (C876.2 U11.18), Server_CPU_Power (5 pins), Server_CPU_Sub_Power_Supplies (C1268.2 U15.18)
S1VDD: Public_CPU_Power (15 pins), Private_CPU_Power (16 pins), Server_CPU_Power (16 pins), Public_CPU_SerDes (R230.2), Private_CPU_SerDes (R508.2), Server_CPU_SerDes (R729.2)
S1VDD_SRC: Main_Power (C597.1 IC33.9 IC33.10 R276.2), Private_CPU_Power (L29.1 L30.1), Server_CPU_Power (L56.1 L57.1)
VDD_FA_VDD: Private_CPU_Power (C505.2 C513.2 P9.1 R264.2), Server_CPU_Power (C1033.2 C1041.2 P15.1 R542.2)
VDD_LP: Public_CPU_Power (5 pins), Public_CPU_Reset_IO (IC1.G19), Private_CPU_Power (5 pins), Private_CPU_Reset_IO (IC30.G19), Server_CPU_Power (5 pins), Server_CPU_Reset_IO (IC61.G19)
VDD_USB_HVVD: Private_CPU_Power (7 pins), Server_CPU_Power (7 pins)
VDD_USB_SDVDD: Private_CPU_Power (7 pins), Server_CPU_Power (7 pins)
VDD_USB_SVDD: Private_CPU_Power (7 pins), Server_CPU_Power (7 pins)
X1VDD: Public_CPU_Power (17 pins), Private_CPU_Power (17 pins), Server_CPU_Power (17 pins), Public_CPU_SerDes (R229.2), Private_CPU_SerDes (R507.2), Server_CPU_SerDes (R728.2)
NetIC30_D1: Private_CPU_USB (IC30.D1), Private_CPU_DDR4 (IC30.D1)
NetIC61_D1: Server_CPU_USB (IC61.D1), Server_CPU_DDR4 (IC61.D1)
PU_USB2_PORT2_3_TXDP: Public_CPU_USB (C200.1 C200.2 IC1.D1 J?#2.6), Public_CPU_DDR4 (IC1.D1)